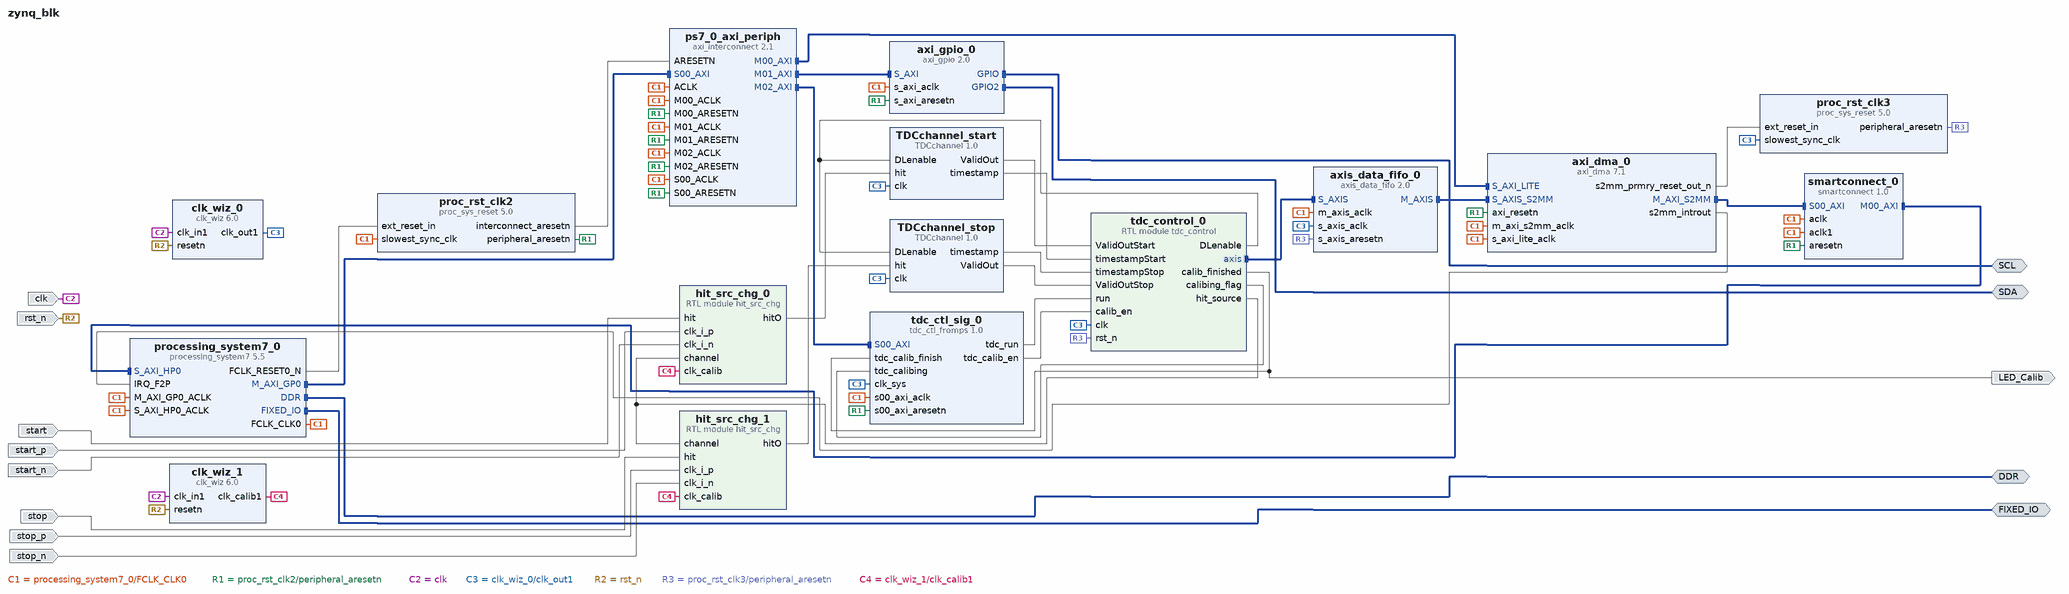
[diagram p0: block diagram of the top level]
# Vivado block design zynq_blk, xc7z020clg484-2, Vivado 2018.3
create_bd_design zynq_blk

create_bd_intf_port -mode Master -vlnv xilinx.com:interface:ddrx_rtl:1.0 DDR
create_bd_intf_port -mode Master -vlnv xilinx.com:display_processing_system7:fixedio_rtl:1.0 FIXED_IO
create_bd_intf_port -mode Master -vlnv xilinx.com:interface:gpio_rtl:1.0 SCL
create_bd_intf_port -mode Master -vlnv xilinx.com:interface:gpio_rtl:1.0 SDA
create_bd_port -dir I -type clk clk
set_property -dict {CONFIG.FREQ_HZ 50000000} [get_bd_ports clk]
create_bd_port -dir I -type rst rst_n
set_property -dict {CONFIG.POLARITY ACTIVE_LOW} [get_bd_ports rst_n]
create_bd_port -dir I start
create_bd_port -dir I stop
create_bd_port -dir I stop_p
create_bd_port -dir I stop_n
create_bd_port -dir I start_p
create_bd_port -dir I start_n
create_bd_port -dir O LED_Calib

create_bd_cell -type ip -vlnv xilinx.com:ip:processing_system7:5.5 processing_system7_0
set_property -dict [list \
  CONFIG.PCW_ENET0_ENET0_IO {MIO 16 .. 27} \
  CONFIG.PCW_ENET0_GRP_MDIO_ENABLE 1 \
  CONFIG.PCW_ENET0_GRP_MDIO_IO {MIO 52 .. 53} \
  CONFIG.PCW_ENET0_PERIPHERAL_ENABLE 1 \
  CONFIG.PCW_FPGA0_PERIPHERAL_FREQMHZ 100 \
  CONFIG.PCW_IRQ_F2P_INTR 1 \
  CONFIG.PCW_PRESET_BANK1_VOLTAGE {LVCMOS 1.8V} \
  CONFIG.PCW_QSPI_GRP_SINGLE_SS_ENABLE 1 \
  CONFIG.PCW_QSPI_GRP_SINGLE_SS_IO {MIO 1 .. 6} \
  CONFIG.PCW_QSPI_PERIPHERAL_ENABLE 1 \
  CONFIG.PCW_QSPI_QSPI_IO {MIO 1 .. 6} \
  CONFIG.PCW_SINGLE_QSPI_DATA_MODE x4 \
  CONFIG.PCW_UART1_PERIPHERAL_ENABLE 1 \
  CONFIG.PCW_UART1_UART1_IO {MIO 48 .. 49} \
  CONFIG.PCW_UART_PERIPHERAL_FREQMHZ 100 \
  CONFIG.PCW_UIPARAM_DDR_PARTNO {MT41J256M16 RE-125} \
  CONFIG.PCW_USE_FABRIC_INTERRUPT 1 \
  CONFIG.PCW_USE_S_AXI_HP0 1 \
] [get_bd_cells processing_system7_0]
# 109 more settings of processing_system7_0 are not shown: defaults, MIO pin electricals, DDR timing, and values the tool derives
create_bd_cell -type ip -vlnv xilinx.com:ip:axis_data_fifo:2.0 axis_data_fifo_0
set_property -dict [list \
  CONFIG.FIFO_DEPTH 2048 \
  CONFIG.HAS_TKEEP 1 \
  CONFIG.HAS_TLAST 1 \
  CONFIG.IS_ACLK_ASYNC 1 \
  CONFIG.SYNCHRONIZATION_STAGES 2 \
  CONFIG.TDATA_NUM_BYTES 8 \
] [get_bd_cells axis_data_fifo_0]
create_bd_cell -type ip -vlnv xilinx.com:ip:axi_dma:7.1 axi_dma_0
set_property -dict [list \
  CONFIG.c_include_mm2s 0 \
  CONFIG.c_include_sg 0 \
  CONFIG.c_micro_dma 0 \
  CONFIG.c_s2mm_burst_size 64 \
] [get_bd_cells axi_dma_0]
create_bd_cell -type ip -vlnv xilinx.com:ip:smartconnect:1.0 smartconnect_0
set_property -dict {CONFIG.NUM_CLKS 2 CONFIG.NUM_SI 1} [get_bd_cells smartconnect_0]
create_bd_cell -type ip -vlnv xilinx.com:ip:proc_sys_reset:5.0 proc_rst_clk2
create_bd_cell -type ip -vlnv xilinx.com:ip:axi_interconnect:2.1 ps7_0_axi_periph
set_property -dict {CONFIG.NUM_MI 3} [get_bd_cells ps7_0_axi_periph]
create_bd_cell -type ip -vlnv xilinx.com:ip:clk_wiz:6.0 clk_wiz_0
set_property -dict [list \
  CONFIG.CLKIN1_JITTER_PS 200.0 \
  CONFIG.CLKOUT1_JITTER 128.846 \
  CONFIG.CLKOUT1_PHASE_ERROR 163.922 \
  CONFIG.CLKOUT1_REQUESTED_OUT_FREQ 350 \
  CONFIG.CLKOUT1_USED true \
  CONFIG.CLKOUT2_JITTER 201.513 \
  CONFIG.CLKOUT2_PHASE_ERROR 143.018 \
  CONFIG.CLKOUT2_USED false \
  CONFIG.MMCM_CLKFBOUT_MULT_F 20.125 \
  CONFIG.MMCM_CLKIN1_PERIOD 20.000 \
  CONFIG.MMCM_CLKIN2_PERIOD 10.0 \
  CONFIG.MMCM_CLKOUT0_DIVIDE_F 2.875 \
  CONFIG.MMCM_CLKOUT1_DIVIDE 1 \
  CONFIG.MMCM_DIVCLK_DIVIDE 1 \
  CONFIG.NUM_OUT_CLKS 1 \
  CONFIG.PRIM_IN_FREQ 50 \
  CONFIG.RESET_PORT resetn \
  CONFIG.RESET_TYPE ACTIVE_LOW \
  CONFIG.USE_LOCKED false \
  CONFIG.USE_RESET true \
] [get_bd_cells clk_wiz_0]
create_bd_cell -type ip -vlnv xilinx.com:user:TDCchannel:1.0 TDCchannel_start
set_property -dict {CONFIG.NTaps 192} [get_bd_cells TDCchannel_start]
create_bd_cell -type ip -vlnv xilinx.com:user:TDCchannel:1.0 TDCchannel_stop
set_property -dict {CONFIG.NTaps 192} [get_bd_cells TDCchannel_stop]
create_bd_cell -type ip -vlnv xilinx.com:ip:axi_gpio:2.0 axi_gpio_0
set_property -dict [list \
  CONFIG.C_ALL_OUTPUTS 0 \
  CONFIG.C_GPIO2_WIDTH 1 \
  CONFIG.C_GPIO_WIDTH 1 \
  CONFIG.C_IS_DUAL 1 \
] [get_bd_cells axi_gpio_0]
create_bd_cell -type ip -vlnv xilinx.com:ip:proc_sys_reset:5.0 proc_rst_clk3
create_bd_cell -type ip -vlnv xilinx.com:ip:clk_wiz:6.0 clk_wiz_1
set_property -dict [list \
  CONFIG.CLKIN1_JITTER_PS 200.0 \
  CONFIG.CLKOUT1_DRIVES BUFG \
  CONFIG.CLKOUT1_JITTER 306.089 \
  CONFIG.CLKOUT1_PHASE_ERROR 411.791 \
  CONFIG.CLKOUT1_REQUESTED_OUT_FREQ 35.02627 \
  CONFIG.CLKOUT1_USED true \
  CONFIG.CLKOUT2_DRIVES BUFG \
  CONFIG.CLKOUT2_JITTER 493.492 \
  CONFIG.CLKOUT2_PHASE_ERROR 622.160 \
  CONFIG.CLKOUT2_REQUESTED_OUT_FREQ 35.02627 \
  CONFIG.CLKOUT2_REQUESTED_PHASE 180 \
  CONFIG.CLKOUT2_USED false \
  CONFIG.CLKOUT3_DRIVES BUFG \
  CONFIG.CLKOUT4_DRIVES BUFG \
  CONFIG.CLKOUT5_DRIVES BUFG \
  CONFIG.CLKOUT6_DRIVES BUFG \
  CONFIG.CLKOUT7_DRIVES BUFG \
  CONFIG.CLK_OUT1_PORT clk_calib1 \
  CONFIG.CLK_OUT2_PORT clk_calib2 \
  CONFIG.MMCM_CLKFBOUT_MULT_F 62.000 \
  CONFIG.MMCM_CLKIN1_PERIOD 20.000 \
  CONFIG.MMCM_CLKIN2_PERIOD 10.0 \
  CONFIG.MMCM_CLKOUT0_DIVIDE_F 29.500 \
  CONFIG.MMCM_CLKOUT1_DIVIDE 1 \
  CONFIG.MMCM_CLKOUT1_PHASE 180.000 \
  CONFIG.MMCM_DIVCLK_DIVIDE 3 \
  CONFIG.NUM_OUT_CLKS 1 \
  CONFIG.PRIM_IN_FREQ 50 \
  CONFIG.PRIM_SOURCE No_buffer \
  CONFIG.RESET_PORT resetn \
  CONFIG.RESET_TYPE ACTIVE_LOW \
  CONFIG.SECONDARY_SOURCE Single_ended_clock_capable_pin \
  CONFIG.USE_INCLK_STOPPED false \
  CONFIG.USE_LOCKED false \
  CONFIG.USE_PHASE_ALIGNMENT true \
] [get_bd_cells clk_wiz_1]
create_bd_cell -type ip -vlnv xilinx.com:user:tdc_ctl_fromps:1.0 tdc_ctl_sig_0
create_bd_cell -type module -reference tdc_control tdc_control_0
create_bd_cell -type module -reference hit_src_chg hit_src_chg_0
create_bd_cell -type module -reference hit_src_chg hit_src_chg_1

# ---- connections ----

connect_bd_intf_net [get_bd_intf_pins tdc_ctl_sig_0/S00_AXI] [get_bd_intf_pins ps7_0_axi_periph/M02_AXI]
connect_bd_intf_net [get_bd_intf_pins smartconnect_0/M00_AXI] [get_bd_intf_pins processing_system7_0/S_AXI_HP0]
connect_bd_intf_net [get_bd_intf_ports SCL] [get_bd_intf_pins axi_gpio_0/GPIO]
connect_bd_intf_net [get_bd_intf_pins ps7_0_axi_periph/M00_AXI] [get_bd_intf_pins axi_dma_0/S_AXI_LITE]
connect_bd_intf_net [get_bd_intf_ports DDR] [get_bd_intf_pins processing_system7_0/DDR]
connect_bd_intf_net [get_bd_intf_pins axis_data_fifo_0/M_AXIS] [get_bd_intf_pins axi_dma_0/S_AXIS_S2MM]
connect_bd_intf_net [get_bd_intf_ports SDA] [get_bd_intf_pins axi_gpio_0/GPIO2]
connect_bd_intf_net [get_bd_intf_pins processing_system7_0/M_AXI_GP0] [get_bd_intf_pins ps7_0_axi_periph/S00_AXI]
connect_bd_intf_net [get_bd_intf_pins tdc_control_0/axis] [get_bd_intf_pins axis_data_fifo_0/S_AXIS]
connect_bd_intf_net [get_bd_intf_pins ps7_0_axi_periph/M01_AXI] [get_bd_intf_pins axi_gpio_0/S_AXI]
connect_bd_intf_net [get_bd_intf_pins axi_dma_0/M_AXI_S2MM] [get_bd_intf_pins smartconnect_0/S00_AXI]
connect_bd_intf_net [get_bd_intf_ports FIXED_IO] [get_bd_intf_pins processing_system7_0/FIXED_IO]
connect_bd_net -net slowest_sync_clk_1 [get_bd_pins processing_system7_0/FCLK_CLK0] \
  [get_bd_pins processing_system7_0/S_AXI_HP0_ACLK] [get_bd_pins processing_system7_0/M_AXI_GP0_ACLK] \
  [get_bd_pins axi_dma_0/s_axi_lite_aclk] [get_bd_pins smartconnect_0/aclk1] [get_bd_pins ps7_0_axi_periph/ACLK] \
  [get_bd_pins ps7_0_axi_periph/S00_ACLK] [get_bd_pins ps7_0_axi_periph/M00_ACLK] [get_bd_pins axis_data_fifo_0/m_axis_aclk] \
  [get_bd_pins proc_rst_clk2/slowest_sync_clk] [get_bd_pins smartconnect_0/aclk] [get_bd_pins axi_dma_0/m_axi_s2mm_aclk] \
  [get_bd_pins axi_gpio_0/s_axi_aclk] [get_bd_pins ps7_0_axi_periph/M01_ACLK] [get_bd_pins ps7_0_axi_periph/M02_ACLK] \
  [get_bd_pins tdc_ctl_sig_0/s00_axi_aclk]
connect_bd_net [get_bd_pins processing_system7_0/FCLK_RESET0_N] [get_bd_pins proc_rst_clk2/ext_reset_in]
connect_bd_net -net rst_ps7_0_100M_1_peripheral_aresetn [get_bd_pins proc_rst_clk2/peripheral_aresetn] \
  [get_bd_pins smartconnect_0/aresetn] [get_bd_pins axi_dma_0/axi_resetn] [get_bd_pins ps7_0_axi_periph/S00_ARESETN] \
  [get_bd_pins ps7_0_axi_periph/M00_ARESETN] [get_bd_pins axi_gpio_0/s_axi_aresetn] \
  [get_bd_pins ps7_0_axi_periph/M01_ARESETN] [get_bd_pins ps7_0_axi_periph/M02_ARESETN] \
  [get_bd_pins tdc_ctl_sig_0/s00_axi_aresetn]
connect_bd_net [get_bd_pins axi_dma_0/s2mm_introut] [get_bd_pins processing_system7_0/IRQ_F2P]
connect_bd_net -net clk_in1_0_1 [get_bd_ports clk] [get_bd_pins clk_wiz_0/clk_in1] [get_bd_pins clk_wiz_1/clk_in1]
connect_bd_net [get_bd_pins clk_wiz_0/clk_out1] \
  [get_bd_pins axis_data_fifo_0/s_axis_aclk] [get_bd_pins TDCchannel_stop/clk] [get_bd_pins TDCchannel_start/clk] \
  [get_bd_pins proc_rst_clk3/slowest_sync_clk] [get_bd_pins tdc_ctl_sig_0/clk_sys] [get_bd_pins tdc_control_0/clk]
connect_bd_net -net reset_rtl_0_1 [get_bd_ports rst_n] [get_bd_pins clk_wiz_0/resetn] [get_bd_pins clk_wiz_1/resetn]
connect_bd_net -net hit_0_1 [get_bd_ports start] [get_bd_pins hit_src_chg_0/hit]
connect_bd_net [get_bd_pins tdc_control_0/DLenable] [get_bd_pins TDCchannel_stop/DLenable] [get_bd_pins TDCchannel_start/DLenable]
connect_bd_net [get_bd_pins proc_rst_clk2/interconnect_aresetn] [get_bd_pins ps7_0_axi_periph/ARESETN]
connect_bd_net [get_bd_pins axi_dma_0/s2mm_prmry_reset_out_n] [get_bd_pins proc_rst_clk3/ext_reset_in]
connect_bd_net [get_bd_pins proc_rst_clk3/peripheral_aresetn] [get_bd_pins axis_data_fifo_0/s_axis_aresetn] [get_bd_pins tdc_control_0/rst_n]
connect_bd_net [get_bd_pins TDCchannel_start/ValidOut] [get_bd_pins tdc_control_0/ValidOutStart]
connect_bd_net [get_bd_pins TDCchannel_start/timestamp] [get_bd_pins tdc_control_0/timestampStart]
connect_bd_net [get_bd_pins TDCchannel_stop/timestamp] [get_bd_pins tdc_control_0/timestampStop]
connect_bd_net [get_bd_pins TDCchannel_stop/ValidOut] [get_bd_pins tdc_control_0/ValidOutStop]
connect_bd_net [get_bd_pins tdc_ctl_sig_0/tdc_run] [get_bd_pins tdc_control_0/run]
connect_bd_net -net tdc_ctl_sig_0_tdc_clr [get_bd_pins tdc_ctl_sig_0/tdc_calib_en] [get_bd_pins tdc_control_0/calib_en]
connect_bd_net [get_bd_pins clk_wiz_1/clk_calib1] [get_bd_pins hit_src_chg_0/clk_calib] [get_bd_pins hit_src_chg_1/clk_calib]
connect_bd_net [get_bd_pins tdc_control_0/hit_source] [get_bd_pins hit_src_chg_0/channel] [get_bd_pins hit_src_chg_1/channel]
connect_bd_net [get_bd_pins hit_src_chg_0/hitO] [get_bd_pins TDCchannel_start/hit]
connect_bd_net [get_bd_pins hit_src_chg_1/hitO] [get_bd_pins TDCchannel_stop/hit]
connect_bd_net [get_bd_ports stop] [get_bd_pins hit_src_chg_1/hit]
connect_bd_net [get_bd_pins tdc_control_0/calib_finished] [get_bd_ports LED_Calib] [get_bd_pins tdc_ctl_sig_0/tdc_calib_finish]
connect_bd_net [get_bd_pins tdc_control_0/calibing_flag] [get_bd_pins tdc_ctl_sig_0/tdc_calibing]
connect_bd_net -net clk_i_p_0_1 [get_bd_ports stop_p] [get_bd_pins hit_src_chg_1/clk_i_p]
connect_bd_net -net clk_i_n_0_1 [get_bd_ports stop_n] [get_bd_pins hit_src_chg_1/clk_i_n]
connect_bd_net -net clk_i_p_1_1 [get_bd_ports start_p] [get_bd_pins hit_src_chg_0/clk_i_p]
connect_bd_net -net clk_i_n_1_1 [get_bd_ports start_n] [get_bd_pins hit_src_chg_0/clk_i_n]

# ---- address map ----
assign_bd_address -offset 0x00000000 -range 1G -target_address_space [get_bd_addr_spaces axi_dma_0/Data_S2MM] [get_bd_addr_segs processing_system7_0/S_AXI_HP0/HP0_DDR_LOWOCM]
assign_bd_address -offset 0x40400000 -range 64K -target_address_space [get_bd_addr_spaces processing_system7_0/Data] [get_bd_addr_segs axi_dma_0/S_AXI_LITE/Reg]
assign_bd_address -offset 0x41200000 -range 64K -target_address_space [get_bd_addr_spaces processing_system7_0/Data] [get_bd_addr_segs axi_gpio_0/S_AXI/Reg]
assign_bd_address -offset 0x43C00000 -range 64K -target_address_space [get_bd_addr_spaces processing_system7_0/Data] [get_bd_addr_segs tdc_ctl_sig_0/S00_AXI/S00_AXI_reg]

validate_bd_design
save_bd_design
